# EasyEDA Pro project ProProject_position_pcb_2024-04-14.epro

# Schematic Schematic1
Create Date: 2023-12-06; Page Name: P1; Project Name: position_pcb; Schematic Name: Schematic1; Update Date: 2023-12-07; Company: 嘉立创EDA; Drawed: 詺; Page Size: A4; Version: V1.0
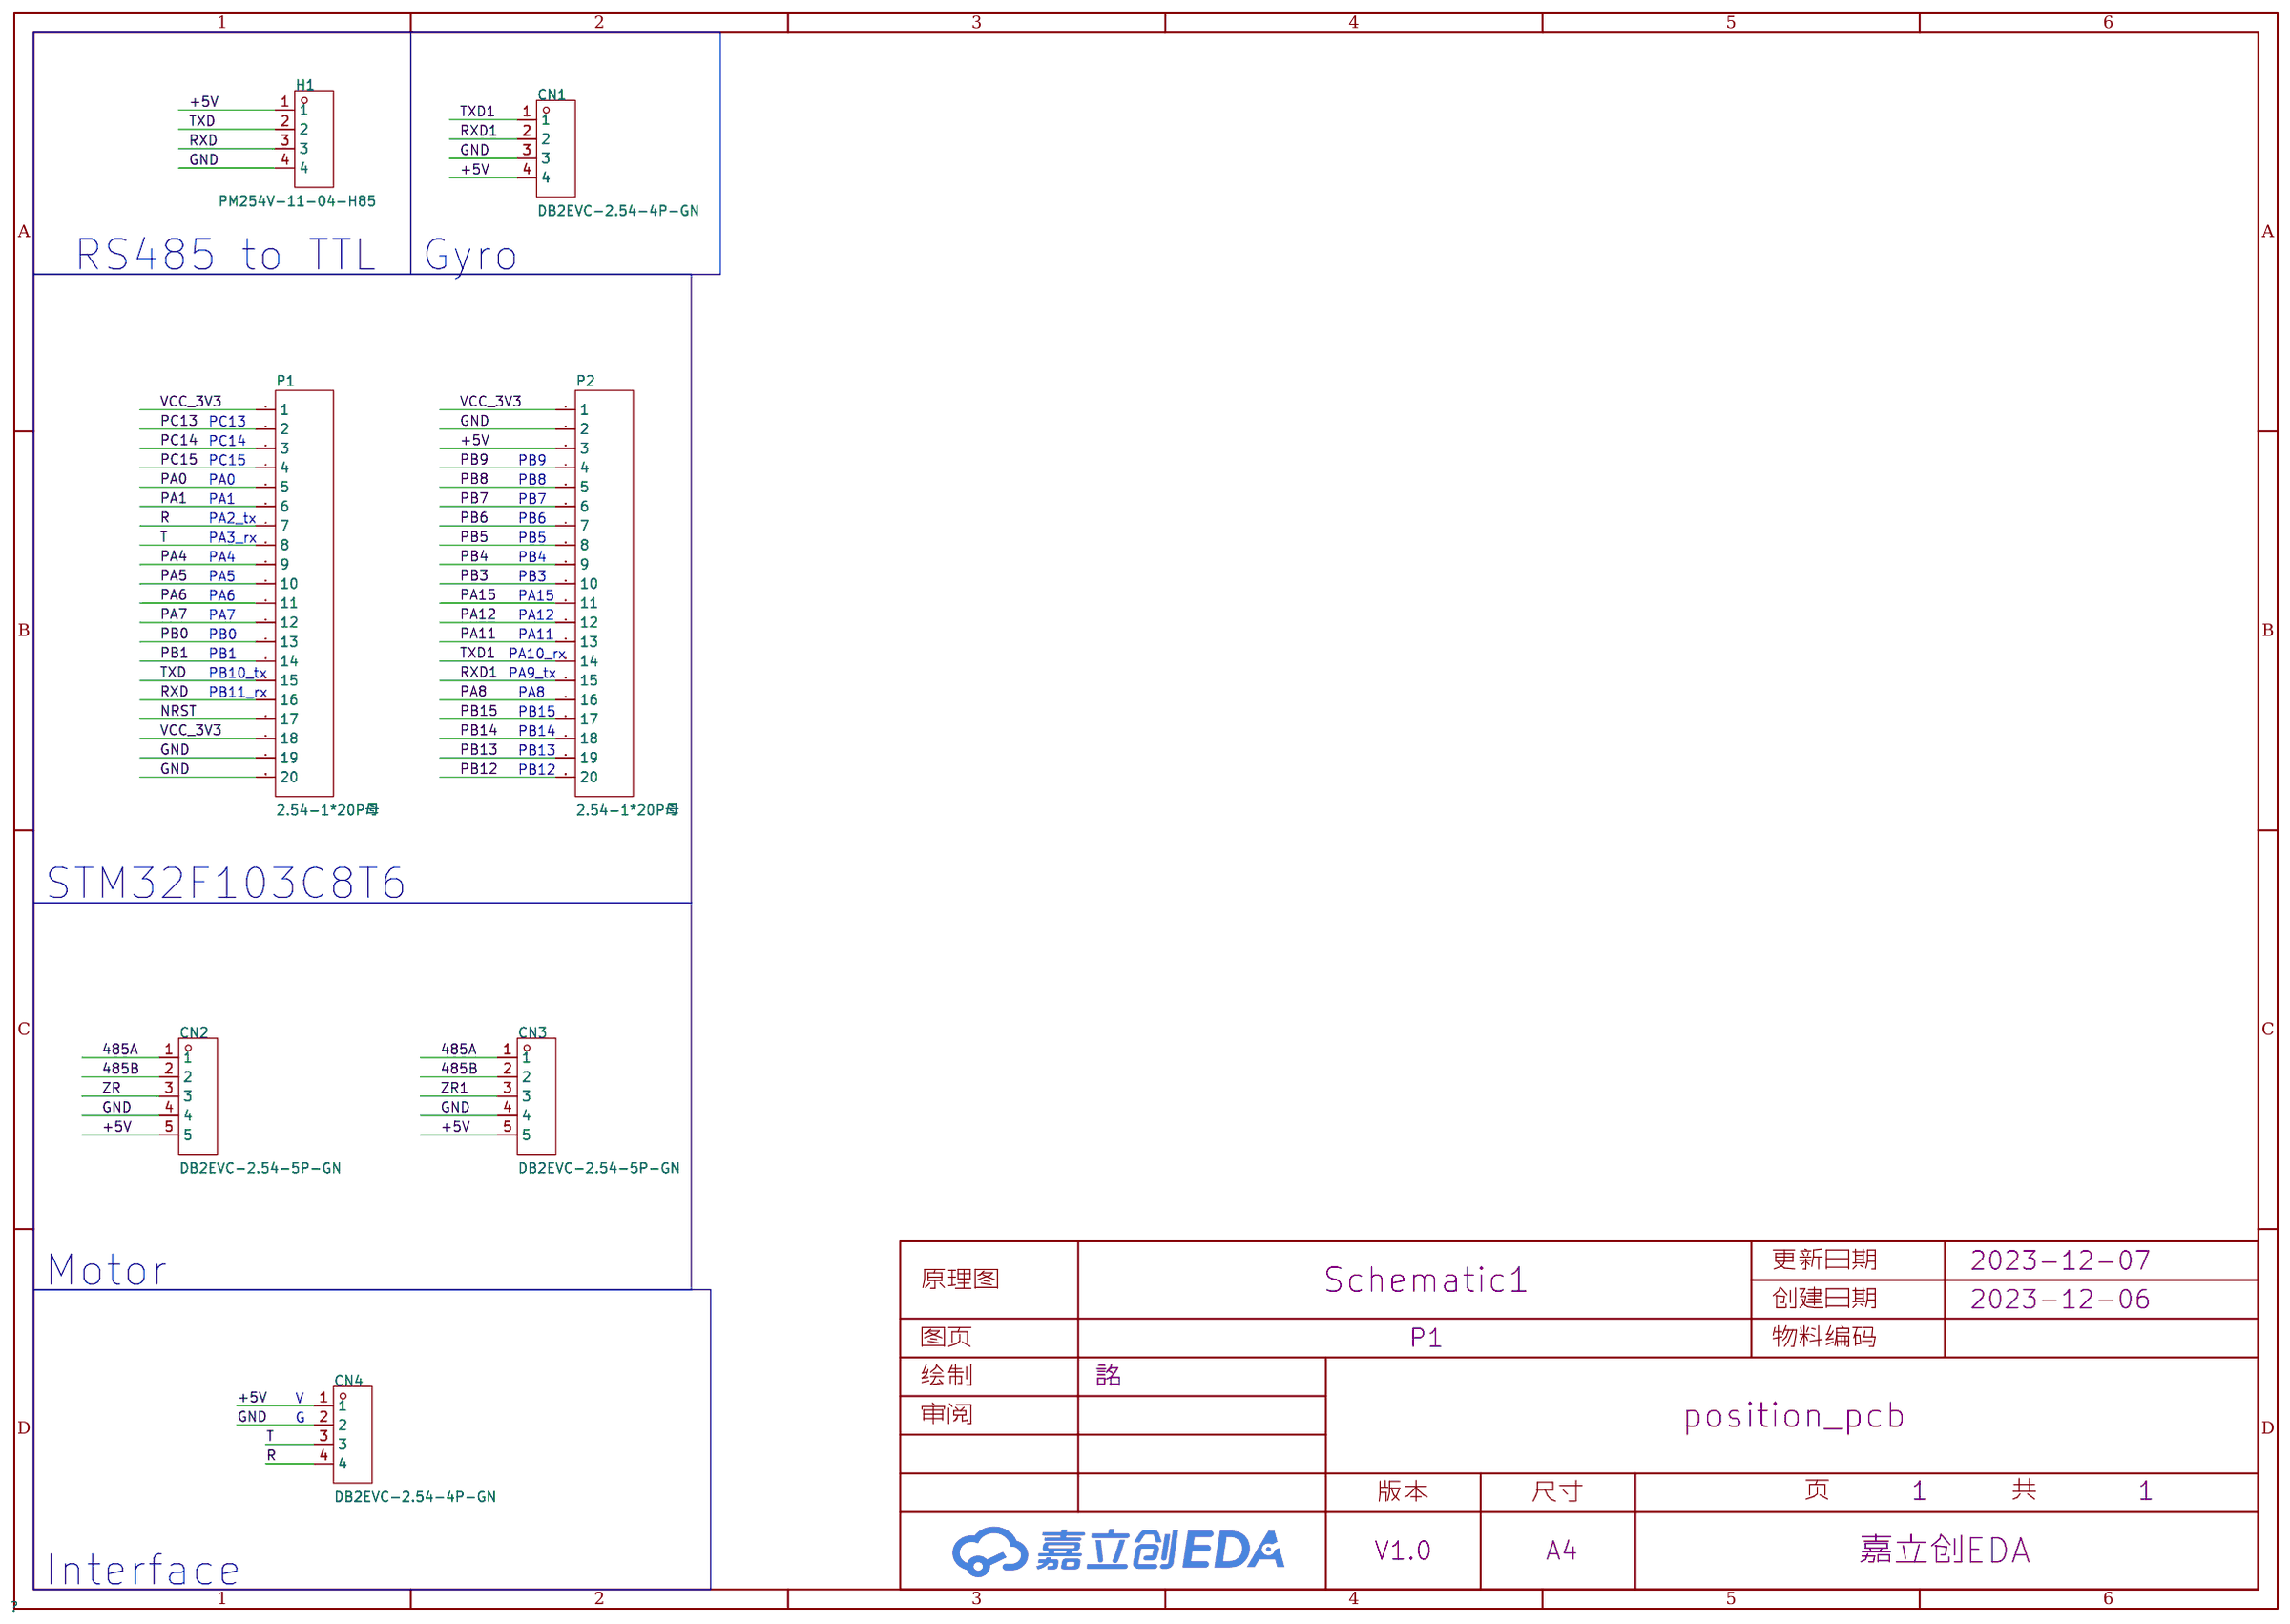
[diagram p0: schematic sheet]

## Parts
CN1  DB2EVC-2.54-4P-GN  [CONN-TH_4P-P2.54_DIBO_DB2EVC-2.54-4P-GN]
CN2  DB2EVC-2.54-5P-GN  [CONN-TH_5P-P2.54_DIBO_DB2EVC-2.54-5P-GN]
CN3  DB2EVC-2.54-5P-GN  [CONN-TH_5P-P2.54_DIBO_DB2EVC-2.54-5P-GN]
CN4  DB2EVC-2.54-4P-GN  [CONN-TH_4P-P2.54_DIBO_DB2EVC-2.54-4P-GN]
H1  PM254V-11-04-H85  [HDR-TH_4P-P2.54-V-F]
P1  2.54-1*20P母  [HDR-TH_20P-P2.54-V-F]
P2  2.54-1*20P母  [HDR-TH_20P-P2.54-V-F]

## Library data of the parts
CN1 CN4 = DB2EVC-2.54-4P-GN: 连接器类型:板端/插座-闭口;间距:2.54mm;结构:1x4P;排数:1;每排PIN数:4;额定电流:5A;额定电压:150V;触头材质:铜合金;触头镀层:锡;工作温度范围:-40℃~+105℃;颜色:绿色;安装方式:直针;; LCSC Part Name: 2.54mm 1x4P 排数:1 每排P数:4; Supplier Part: C2927495; Manufacturer: DIBO(地博电气); Supplier Footprint: 插件,P=2.54mm; JLCPCB Part Class: 扩展库; Datasheet: https://atta.szlcsc.com/upload/public/pdf/source/20230321/FA8558C4B64694DD69E8038406C6376C.pdf; Supplier: LCSC; Connector Type: 板端/插座-闭口; Pitch: 2.54mm; Structure: 1x4P; Number of Rows: 1; Number of PINs Per Row: 4; Number of Pins: 4P; Current Rating (Max): 5A; Voltage Rating (Max): 150V; Contact Material: 铜合金; Contact Plating: 锡; Operating Temperature Range: -40℃~+105℃; Color: 绿色; Mounting Style: 直针
CN2 CN3 = DB2EVC-2.54-5P-GN: 连接器类型:板端/插座-闭口;间距:2.54mm;结构:1x5P;排数:1;每排PIN数:5;额定电流:5A;额定电压:150V;触头材质:铜合金;触头镀层:锡;工作温度范围:-40℃~+105℃;颜色:绿色;安装方式:直针;; LCSC Part Name: 2.54mm 1x5P 排数:1 每排P数:5; Supplier Part: C2927496; Manufacturer: DIBO(地博电气); Supplier Footprint: 插件,P=2.54mm; JLCPCB Part Class: 扩展库; Datasheet: https://atta.szlcsc.com/upload/public/pdf/source/20230321/FA8558C4B64694DD69E8038406C6376C.pdf; Supplier: LCSC; Connector Type: 板端/插座-闭口; Pitch: 2.54mm; Structure: 1x5P; Number of Rows: 1; Number of PINs Per Row: 5; Number of Pins: 5P; Current Rating (Max): 5A; Voltage Rating (Max): 150V; Contact Material: 铜合金; Contact Plating: 锡; Operating Temperature Range: -40℃~+105℃; Color: 绿色; Mounting Style: 直针
H1 = PM254V-11-04-H85: 排数:单排;总孔位数:4P;间距:2.54mm;插孔结构:1x4P;行距:-;安装类型:直插;塑高:-;触头材质:黄铜;触头镀层:-;; LCSC Part Name: 间距:2.54mm 1x4P 直插; Supplier Part: C541851; Manufacturer: XFCN(兴飞); Supplier Footprint: 插件,P=2.54mm; JLCPCB Part Class: 扩展库; Datasheet: https://atta.szlcsc.com/upload/public/pdf/source/20200518/C541849_85853D71FC67C51915A806977A588FDA.pdf; Supplier: LCSC; Number of Rows: 单排; Number of Holes: 4P; Pitch: 2.54mm; Holes Structure: 1x4P; Mounting Type: 直插; Contact Material: 黄铜
P1 P2 = 2.54-1*20P母: 排数:单排;总孔位数:20;间距:2.54mm;插孔结构:1x20P;行距:-;安装类型:直插;塑高:-;触头材质:-;触头镀层:-;; LCSC Part Name: 2.54mm 1x20P; Supplier Part: C50984; Manufacturer: BOOMELE(博穆精密); Supplier Footprint: 插件,P=2.54mm; JLCPCB Part Class: 扩展库; Datasheet: https://atta.szlcsc.com/upload/public/pdf/source/20151109/1457707571590.pdf; Supplier: LCSC; Number of Rows: 单排; Number of Holes: 20; Pitch: 2.54mm; Holes Structure: 1x20P; Mounting Type: 直插

## Nets
+5V: CN1.4 CN2.5 CN3.5 CN4.1 H1.1 P2.3
GND: CN1.3 CN2.4 CN3.4 CN4.2 H1.4 P1.19 P1.20 P2.2
VCC_3V3: P1.1 P1.18 P2.1
485A: CN2.1 CN3.1
485B: CN2.2 CN3.2
NRST: P1.17
PA0: P1.5
PA1: P1.6
PA4: P1.9
PA5: P1.10
PA6: P1.11
PA7: P1.12
PA8: P2.16
PA11: P2.13
PA12: P2.12
PA15: P2.11
PB0: P1.13
PB1: P1.14
PB3: P2.10
PB4: P2.9
PB5: P2.8
PB6: P2.7
PB7: P2.6
PB8: P2.5
PB9: P2.4
PB12: P2.20
PB13: P2.19
PB14: P2.18
PB15: P2.17
PC13: P1.2
PC14: P1.3
PC15: P1.4
R: CN4.4 P1.7
RXD: H1.3 P1.16
RXD1: CN1.2 P2.15
T: CN4.3 P1.8
TXD: H1.2 P1.15
TXD1: CN1.1 P2.14
ZR: CN2.3
ZR1: CN3.3

## Notes on the sheet
- RS485 to TTL
- Gyro
- PC13
- PC14
- PC15
- PB9
- PA0
- PB8
- PA1
- PA2_tx
- PB6
- PB7
- PA3_rx
- PB5
- PA4
- PB4
- PA5
- PB3
- PA6
- PA15
- PA7
- PA12
- PB0
- PB1
- PA10_rx
- PA11
- PB10_tx
- PA9_tx
- PB11_rx
- PA8
- PB15
- PB14
- PB12
- PB13
- STM32F103C8T6
- Motor
- V
- G
- Interface

# Board PCB1
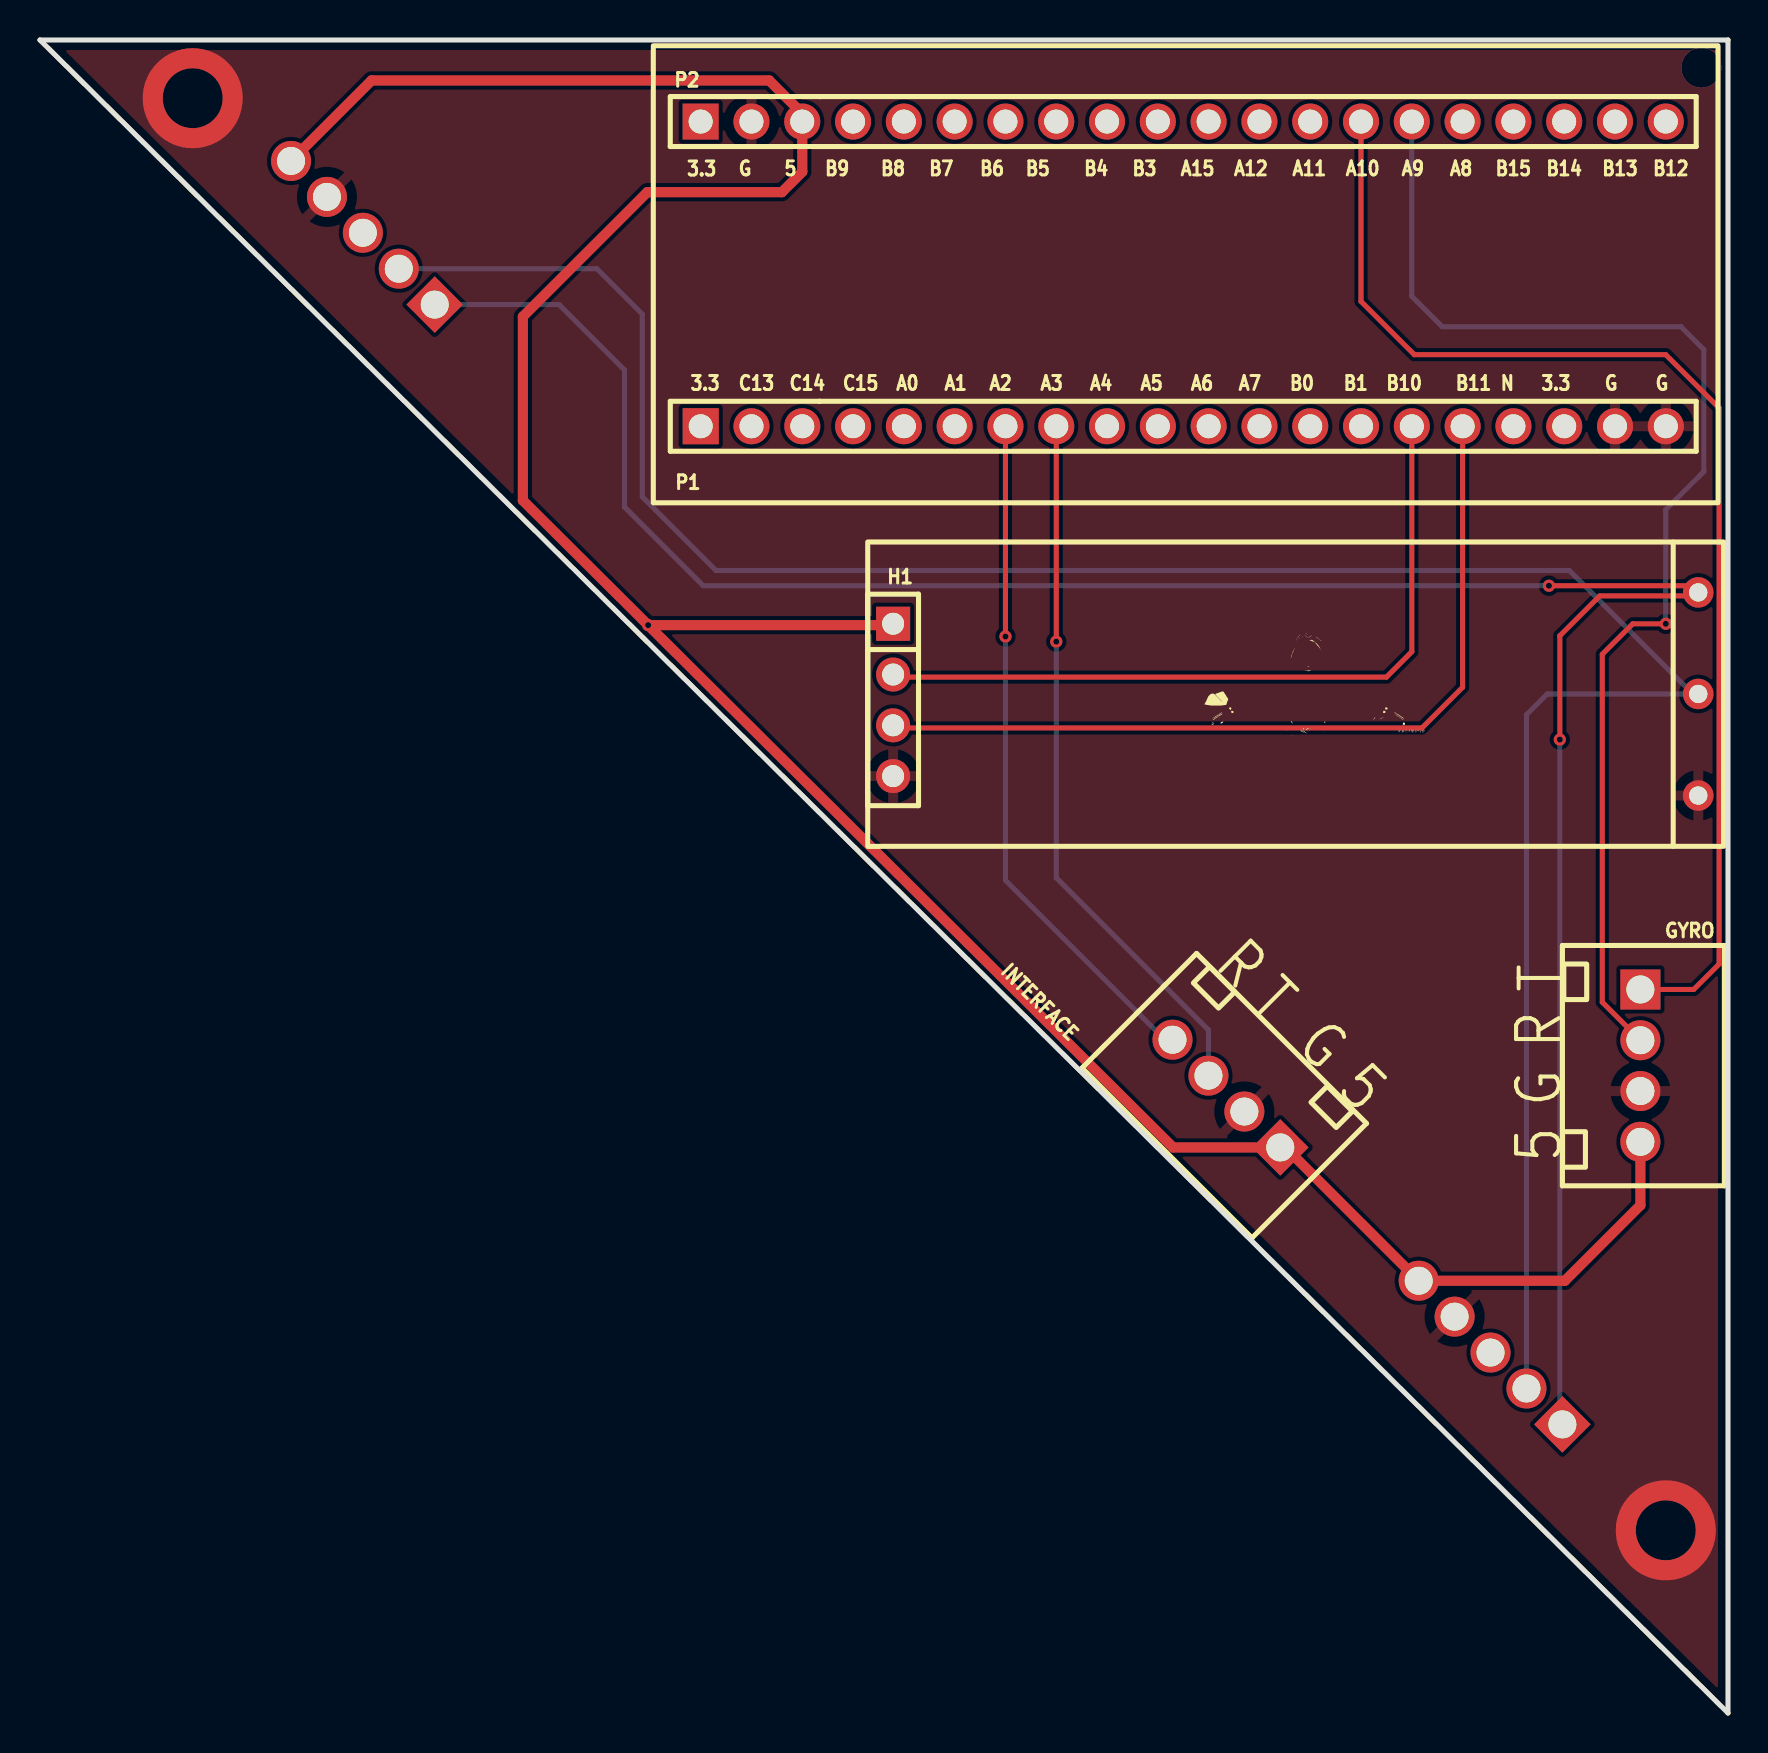
[diagram p1: board, top side]
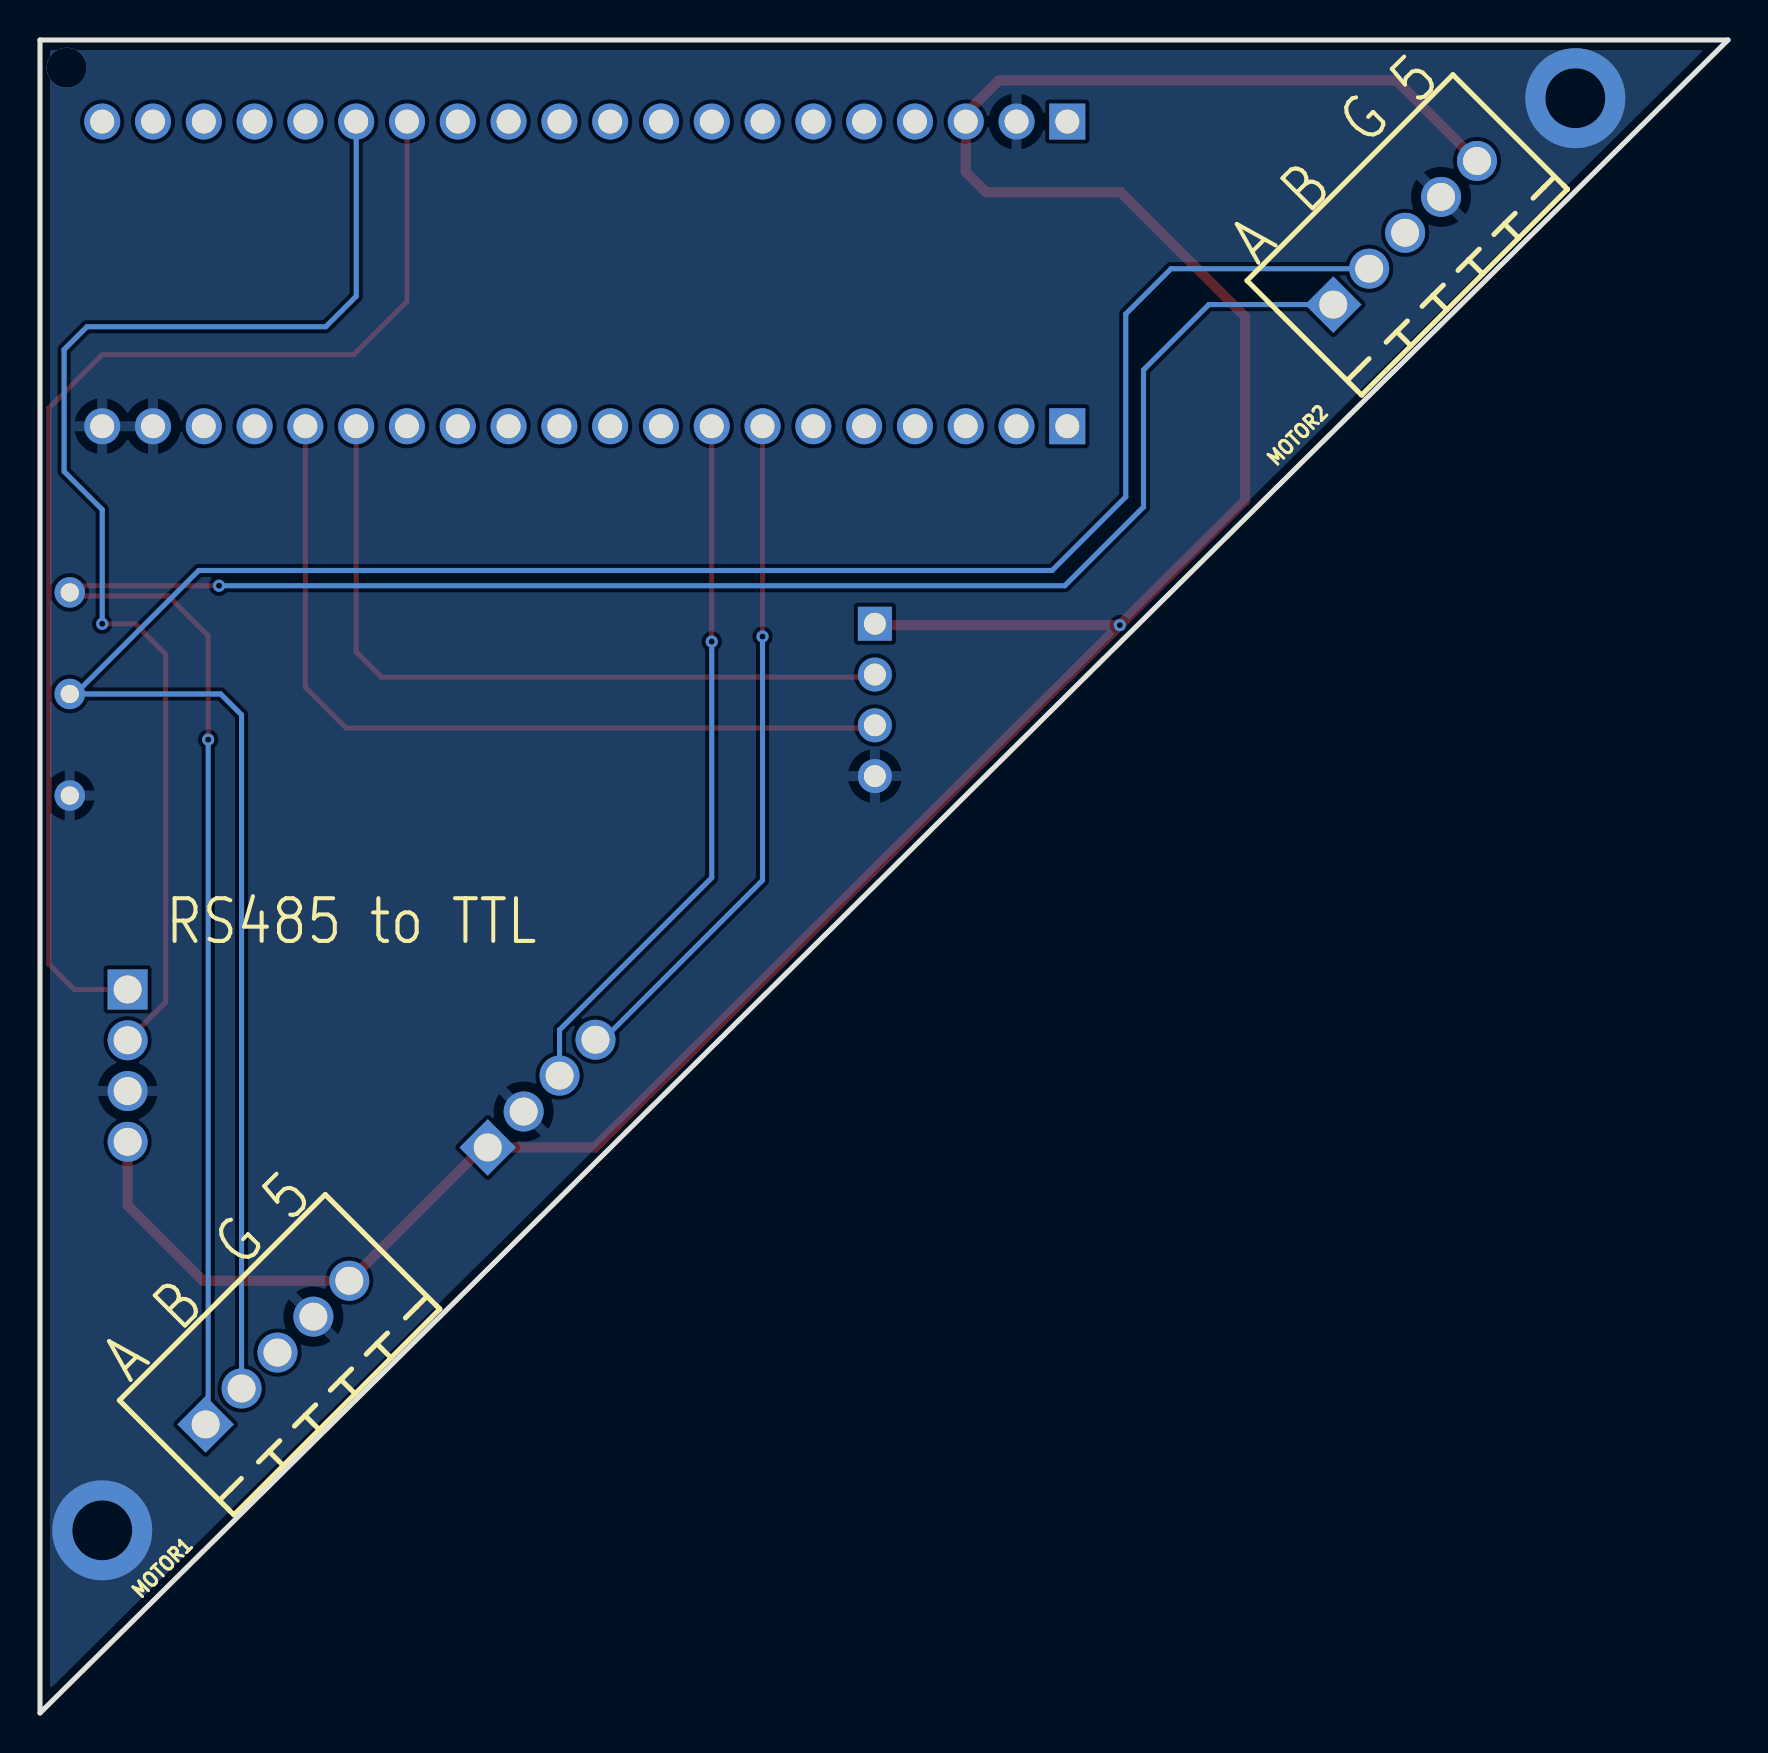
[diagram p2: board, bottom side, seen from below]

Outline 84.41 x 83.68 mm; copper layers: Top Layer, Bottom Layer. Coordinates in mm from the lower left corner of the outline.
Outline path: 0,83.68 84.41,83.68 84.41,0 0,83.68
Stack: Top Layer 0.035mm / Dielectric1 1.51mm FR4 er 4.5 / Bottom Layer 0.035mm

## Design rules (mm)
template: JLCPCB Capability(Two Layers Board)
spacing copperThickness1oz (default): track to track 0.102, other pairs 0.152 to 0.3
spacing copperThickness2oz: track to track 0.203, other pairs 0.152 to 0.3
track width copperThickness1oz (default): min 0.127, default 0.254, max 2.54
track width copperThickness2oz: min 0.203, default 0.254, max 2.54
differential pair differentialPair (default): width min 0.127, default 0.254, max 2.54; gap min 0.152, default 0.152
via viaSize (default): diameter min 0.5, default 0.61, max 10; hole min 0.3, default 0.305, max 6.3

## Placement (name value [footprint] x y rotation side)
GYRO  DB2EVC-2.54-4P-GN  [CONN-TH_4P-P2.54_DIBO_DB2EVC-2.54-4P-GN]  80.03 32.38 270 top
H1  PM254V-11-04-H85  [HDR-TH_4P-P2.54-V-F]  42.66 50.67 270 top
INTERFACE  DB2EVC-2.54-4P-GN  [CONN-TH_4P-P2.54_DIBO_DB2EVC-2.54-4P-GN]  59.33 30.98 135 top
MOTOR1  DB2EVC-2.54-5P-GN  [CONN-TH_5P-P2.54_DIBO_DB2EVC-2.54-5P-GN]  72.53 18.03 135 bottom
MOTOR2  DB2EVC-2.54-5P-GN  [CONN-TH_5P-P2.54_DIBO_DB2EVC-2.54-5P-GN]  16.15 74.03 135 bottom
NOREF  -  [Pad_e58]  82.92 56.05 0 top
NOREF#2  -  [Pad_e60]  82.92 50.97 0 top
NOREF#3  -  [Pad_e61]  82.92 45.89 0 top
P1  2.54-1*20P母  [HDR-TH_20P-P2.54-V-F]  57.17 64.36 0 top
P2  2.54-1*20P母  [HDR-TH_20P-P2.54-V-F]  57.17 79.6 0 top

## Footprints (pads in the part's own frame, mm; a bottom-side part is the same pattern mirrored in y, then rotated)
CONN-TH_4P-P2.54_DIBO_DB2EVC-2.54-4P-GN
  rect 2x2 hole 1.4: 1(-3.81,0)
  round 2 hole 1.4: 2(-1.27,0) 3(1.27,0) 4(3.81,0)
CONN-TH_5P-P2.54_DIBO_DB2EVC-2.54-5P-GN
  rect 2x2 hole 1.4: 1(-5.08,0)
  round 2 hole 1.4: 2(-2.54,0) 3(0,0) 4(2.54,0) 5(5.08,0)
HDR-TH_4P-P2.54-V-F
  rect 1.7x1.7 hole 1.1: 1(-3.81,0)
  round 1.7 hole 1.1: 2(-1.27,0) 3(1.27,0) 4(3.81,0)
HDR-TH_20P-P2.54-V-F
  rect 1.8x1.8 hole 1.2: 1(-24.13,0)
  round 1.8 hole 1.2: 2(-21.59,0) 3(-19.05,0) 4(-16.51,0) 5(-13.97,0) 6(-11.43,0) 7(-8.89,0) 8(-6.35,0) 9(-3.81,0) 10(-1.27,0) 11(1.27,0) 12(3.81,0) 13(6.35,0) 14(8.89,0) 15(11.43,0) 16(13.97,0) 17(16.51,0) 18(19.05,0) 19(21.59,0) 20(24.13,0)
Pad_e58
  round 1.524 hole 0.914: A(0,0)
Pad_e60
  round 1.524 hole 0.914: B(0,0)
Pad_e61
  round 1.524 hole 0.914: G(0,0)

## Nets
As in the schematic, except:
+5V: GYRO.4 H1.1 INTERFACE.1 MOTOR1.5 MOTOR2.5 P2.3
GND: GYRO.3 H1.4 INTERFACE.2 MOTOR1.4 MOTOR2.4 NOREF#3.G P1.19 P1.20 P2.2
485A: MOTOR1.1 MOTOR2.1 NOREF.A
485B: MOTOR1.2 MOTOR2.2 NOREF#2.B
R: INTERFACE.4 P1.7
RXD1: GYRO.2 P2.15
T: INTERFACE.3 P1.8
TXD1: GYRO.1 P2.14

## Via types
v1: diameter 5, hole 3, Top Layer to Bottom Layer, 2 vias
v2: diameter 2, hole 2, Top Layer to Bottom Layer, 1 via
v3: diameter 0.61, hole 0.305, Top Layer to Bottom Layer, 6 vias

## Routing (per net, layer and track width the routed paths; a pad name or vN(x,y) marks a point on that pad's centre or on a via; arc(x,y) is an arc through that point)
+5V: length 146
  Top Layer w0.508: 12.55,77.63 16.58,81.65 36.47,81.65 38.12,80 P2.3 38.12,77.08 37.1,76.07 30.37,76.07 24.15,69.84 24.15,60.65 v3(30.41,54.41) ; v3(30.41,54.41) 42.59,54.41 H1.1 ; v3(30.41,54.41) 56.66,28.29 62.27,28.29 68.94,21.62 76.25,21.62 80.03,25.39 GYRO.4
GND:
  vias: v1(7.64,80.77) v1(81.3,9.14) v2(83.07,82.29)
485A: length 120.3
  Top Layer w0.254: v3(76,48.69) 76,53.88 77.99,55.87 82.74,55.87 NOREF.A 82.59,56.38 v3(75.45,56.38)
  Bottom Layer w0.254: v3(75.45,56.38) 33.16,56.38 29.23,60.32 29.23,67.18 25.96,70.44 MOTOR2.1 ; MOTOR1.1 76,14.56 76,48.51
485B: length 121.6
  Bottom Layer w0.254: MOTOR1.2 74.33,49.92 75.38,50.97 82.65,50.97 ; 82.65,50.97 NOREF#2.B ; 82.65,50.97 76.47,57.14 33.8,57.14 30.12,60.83 30.12,69.97 27.85,72.24 MOTOR2.2
R: length 34.4
  Top Layer w0.254: P1.7 v3(48.28,53.84)
  Bottom Layer w0.254: INTERFACE.4 56.25,33.68 48.28,41.65 v3(48.28,53.84)
RXD: length 42.4
  Top Layer w0.254: H1.3 42.79,49.27 69.1,49.27 71.14,51.3 P1.16
RXD1: length 62.9
  Top Layer w0.254: GYRO.2 78.12,35.55 78.12,52.95 79.65,54.48 v3(81.3,54.48)
  Bottom Layer w0.254: v3(81.3,54.48) 81.3,60.19 83.2,62.1 83.2,68.19 82.06,69.34 70.12,69.34 68.6,70.86 P2.15
T: length 35.6
  Top Layer w0.254: P1.8 v3(50.82,53.59)
  Bottom Layer w0.254: v3(50.82,53.59) 50.82,41.77 58.43,34.17 INTERFACE.3
TXD: length 37.8
  Top Layer w0.254: P1.15 68.6,53.08 67.33,51.81 42.79,51.81 H1.2
TXD1: length 61.4
  Top Layer w0.254: GYRO.1 82.69,36.19 83.96,37.46 83.96,65.27 81.3,67.94 68.72,67.94 66.06,70.61 P2.14

## Copper pours and planes (outline as drawn; the poured copper is in the pictures)
GND on Top Layer: -30.84,99.43 139.34,99.43 139.34,-27.95 -30.84,-27.95
GND on Bottom Layer: -9.13,91.18 124.35,91.18 124.35,-9.02 -9.13,-9.02

## Text on the board
Bottom Silkscreen Layer: RS485 to TTL | 5 | G | A | B
Top Silkscreen Layer: 3.3 | G | C13 | 5 | C14 | B9 | C15 | B8 | A0 | B7 | A1 | B6 | A2 | B5 | A3 | B4 | A4 | B3 | A5 | A15 | A6 | A12 | A7 | B0 | A11 | B1 | A10 | B10 | A9 | A8 | B11 | B15 | N | B14 | B13 | B12 | R | T
